# Altium project M2.PrjPcb
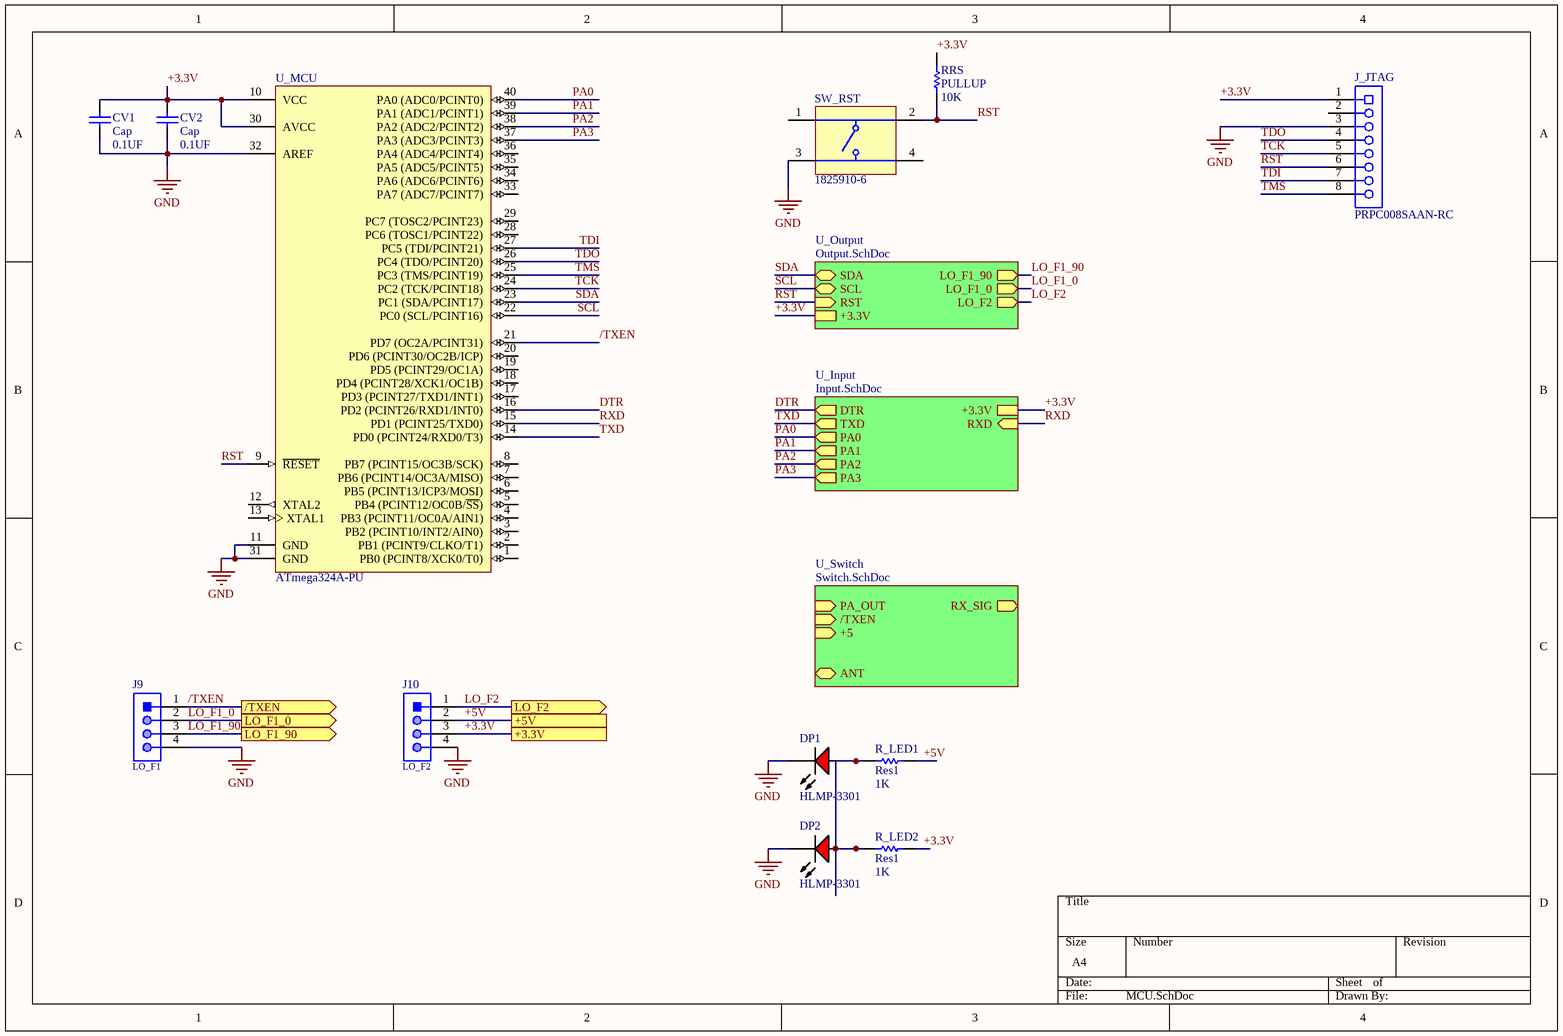
[diagram p0: MCU.SchDoc]
3 sheets, 32 parts. Net scope: hierarchical (ports join the sheet entries above them; power ports are global).
Sheets:
  MCU.SchDoc
    U_Output = Output.SchDoc
    U_Input = Input.SchDoc

## Sheet MCU.SchDoc
size A4; SheetNumber: 1; SheetTotal: 4

### Parts
CV1  Cap  value 0.1UF  [1206]
CV2  Cap  value 0.1UF  [1206]
DP1  HLMP-3301  [AVAG-HLMP-3301-2]
DP2  HLMP-3301  [AVAG-HLMP-3301-2]
J9  LO_F1  [61300411121]
J10  LO_F2  [61300411121]
J_JTAG  PRPC008SAAN-RC  [SLIN-PPPC081LFBN-RC_V]
R_LED1  Res1  value 1K  [AXIAL-0.1-RES]
R_LED2  Res1  value 1K  [AXIAL-0.1-RES]
RRS  PULLUP  value 10K  [AXIAL-0.1-RES]
SW_RST  1825910-6  [TECO-1825910-6_V]
U_MCU  ATmega324A-PU  [40P6]

### Sub-sheets
U_Input = Input.SchDoc: +3.3V, DTR (out), RXD (in), TXD (out), PA0 (out), PA1 (out), PA2 (out), PA3 (out)
U_Output = Output.SchDoc: SDA (bidir), SCL (bidir), RST (in), LO_F1_90 (out), LO_F1_0 (out), LO_F2 (out), +3.3V
U_Switch = Switch.SchDoc (file not in this document): PA_OUT (in), ANT (bidir), /TXEN (in), +5 (in), RX_SIG (out)

### Ports
+3.3V, +5V, /TXEN (out), LO_F1_0 (out), LO_F1_90 (out), LO_F2 (out)

### Nets
GND: CV1.1 CV2.1 DP1.1(K) DP2.1(K) J9.4 J10.4 J_JTAG.3 SW_RST.3 U_MCU.11(GND) U_MCU.31(GND) U_MCU.32(AREF)
+3.3V: CV1.2 CV2.2 J10.3 J_JTAG.1 R_LED2.2 RRS.2 U_MCU.10(VCC) U_MCU.30(AVCC) ; port +3.3V, sheet U_Output/+3.3V, sheet U_Input/+3.3V  [project net  +3.3V]
+5V: J10.2 R_LED1.2 ; port +5V
/TXEN: J9.1 U_MCU.21(PD7_(OC2A/PCINT31)) ; port /TXEN
DTR: U_MCU.16(PD2_(PCINT26/RXD1/INT0)) ; sheet U_Input/DTR
LO_F1_0: J9.2 ; port LO_F1_0, sheet U_Output/LO_F1_0
LO_F1_90: J9.3 ; port LO_F1_90, sheet U_Output/LO_F1_90
LO_F2: J10.1 ; port LO_F2, sheet U_Output/LO_F2
PA0: U_MCU.40(PA0_(ADC0/PCINT0)) ; sheet U_Input/PA0
PA1: U_MCU.39(PA1_(ADC1/PCINT1)) ; sheet U_Input/PA1
PA2: U_MCU.38(PA2_(ADC2/PCINT2)) ; sheet U_Input/PA2
PA3: U_MCU.37(PA3_(ADC3/PCINT3)) ; sheet U_Input/PA3
RST: J_JTAG.6 RRS.1 SW_RST.2 U_MCU.9(~{RESET}) ; sheet U_Output/RST
RXD: U_MCU.15(PD1_(PCINT25/TXD0)) ; sheet U_Input/RXD
SCL: U_MCU.22(PC0_(SCL/PCINT16)) ; sheet U_Output/SCL
SDA: U_MCU.23(PC1_(SDA/PCINT17)) ; sheet U_Output/SDA
TCK: J_JTAG.5 U_MCU.24(PC2_(TCK/PCINT18))
TDI: J_JTAG.7 U_MCU.27(PC5_(TDI/PCINT21))
TDO: J_JTAG.4 U_MCU.26(PC4_(TDO/PCINT20))
TMS: J_JTAG.8 U_MCU.25(PC3_(TMS/PCINT19))
TXD: U_MCU.14(PD0_(PCINT24/RXD0/T3)) ; sheet U_Input/TXD
NetDP1_2: DP1.2(A) DP2.2(A) R_LED1.1 R_LED2.1

Not connected (* = marked no-connect by the designer): J_JTAG 2; SW_RST 1 4; U_MCU 1(PB0_(PCINT8/XCK0/T0)) 2(PB1_(PCINT9/CLKO/T1)) 3(PB2_(PCINT10/INT2/AIN0)) 4(PB3_(PCINT11/OC0A/AIN1)) 5(PB4_(PCINT12/OC0B/~{SS})) 6(PB5_(PCINT13/ICP3/MOSI)) 7(PB6_(PCINT14/OC3A/MISO)) 8(PB7_(PCINT15/OC3B/SCK)) 12(XTAL2) 13(XTAL1) 17(PD3_(PCINT27/TXD1/INT1)) 18(PD4_(PCINT28/XCK1/OC1B)) 19(PD5_(PCINT29/OC1A)) 20(PD6_(PCINT30/OC2B/ICP)) 28(PC6_(TOSC1/PCINT22)) 29(PC7_(TOSC2/PCINT23)) 33(PA7_(ADC7/PCINT7)) 34(PA6_(ADC6/PCINT6)) 35(PA5_(ADC5/PCINT5)) 36(PA4_(ADC4/PCINT4))

### Library data of the parts
CV1 CV2 = CAP CER 0.1UF 50V X7R 1206: Capacitor; Manufacturer Part Number: 885012208087; Designator: C?; Voltage Rating: 50V; Published: 8-Jun-2000; LatestRevisionDate: 17-Jul-2002; LatestRevisionNote: Re-released for DXP Platform.; Publisher: Altium Limited
DP1 DP2 = CMP-2000-06411-1: T-1 3/4 (5 mm) Diffused LED Lamp, 1.9 V, -40 to 100 degC, 2-Pin THD, RoHS, Bulk; Manufacturer: Avago; Forward Current: 25mA; Forward Voltage: 2.4V; Peak Wavelength: 635nm; Shape Type: Circular; High Brightness: No; Main Category: StandardLED; Test Current (It): 10mA; Dominant Wave Length: 626nm; Number of  Elements: 1; Reverse Voltage: 5V; Chip Material: GaP; Product Height (mm): 9.19mm; Lens Type: ColoredDiffused; Viewing Angle: 60deg; Emitting Color: Red; Luminous Intensity: 5.4mcd; Power Dissipation: 85W; DELETED: Compliant; Product Depth (mm): 6.1mm; Package Description: 2-Pin Through Hole LED, Dia 5.85 mm; Mounting Technology: ThroughHole; Manufacturer URL: http://www.avagotech.com/; Package Type: T-13/4; Operating Temp Range: -40Cto100C; Datasheet URL: http://www.avagotech.com/docs/AV02-1558EN; Mounting: ThroughHole; Lens Dimensions: 5.08x5.08x8.3mm; Package Reference: HLMP-3301; Datasheet Version: 03/2015; Pin Count: 2; Packaging: TapeandReel; Type: Uni-Color; Operating Temperature Classification: Industrial; Lum Intensity: 5.4mcd; Rad Hardened: No; Product Length (mm): 6.1mm
J9 J10 = CMP-1502-01064-1: THT Vertical Pin Header WR-PHD, Pitch 2.54 mm, Single Row, 4 pins; Manufacturer: Wurth Elektronik; Withstanding Voltage: 500VAC; Rated Current: 3A; Working Voltage: 250VAC; Pin Number: 4; Gender: Male; Contact Resistance: 20mOhm; Pitch: 2.54mm; Manufacturer URL: http://www.we-online.de; Operating Temperature: -40to105degC; Packaging: Bag; Mounting Technology: THT; Package Reference: 61300411121; Datasheet URL: https://katalog.we-online.de/em/datasheet/6130xx11121.pdf; Publisher: WurthElektronik; Part Number: 61300411121; Row Number: Single; Orientation: Vertical
J_JTAG = CMP-1770-00002-1: Female Header, Pitch 2.54 mm, 1 x 8 Position, Height 8.5 mm, Tail Length 3.2 mm, -40 to 105 degC, RoHS, Bulk; Case\Package: TO-252-3; Rds On Max: 115 mohm; Typical Rise Time: 90 ns; Max Power Dissipation: 2.5 W; Input Capacitance: 350 pF; Elements: 1; Height: 2.39 mm; Min Operating Temperature: -55 degC; RoHSCompliant: true; PackageDescription: Female Header, Pitch 2.54 mm, 1 x 8 Position, Height 8.5 mm, Tail Length 3.2 mm; Length: 6.73 mm; ComponentLink1Description: Datasheet; Package Quantity: 2500; Max Operating Temperature: 150 degC; Width: 6.22 mm; Radiation Hardening: No; Packaging: Tape and Reel; REACH SVHC: No SVHC; Pins: 3; PackageReference: PPPC081LFBN-RC; ComponentLink1URL: http://sullinscorp.com/catalogs/101_PAGE114-115_.100_FEMALE_HDR.pdf; DatasheetVersion: Jan-15; Mount: Surface Mount
R_LED1 R_LED2 = RES 1K OHM 5% 1/4W AXIAL: Resistor; Manufacturer Part Number: CFR-25JB-52-1K; Designator: R?; Power Rating: 1/4W; Tolerance: 0.05; Published: 8-Jun-2000; LatestRevisionDate: 17-Jul-2002; LatestRevisionNote: Re-released for DXP Platform.; Publisher: Altium Limited
RRS = RES 10K OHM 5% 1/4W AXIAL: Resistor; Manufacturer Part Number: CFR-25JB-52-10K; Designator: R?; Power Rating: 1/4W; Tolerance: 0.05; Published: 8-Jun-2000; LatestRevisionDate: 17-Jul-2002; LatestRevisionNote: Re-released for DXP Platform.; Publisher: Altium Limited
SW_RST = CMP-1684-00021-1: Tact Switch, SPST-NO, 0.05 A, -35 to 85 degC, 4-Pin THD, RoHS, Bulk; Manufacturer: TE Connectivity; Maximum Contact Resistance: 100mOhm; Mechanical Life: 100000Cycles; Bushing Type: Unthreaded; Switch Configuration: OFF(ON); Maximum DC Voltage Rating: 24V; Contact Rating @ Voltage: 0.05A@24VDC; Actuator Color: Black; Body Orientation: Straight; Function: MomentaryContact; Illumination: N/R; Actuator Style: RoundButton; Actuator Material: PolybutyleneTerephthalate; Dielectric Strength: 500VAC; Pole Throw Configuration: SPST; Actuator Length: 1.4mm; Product Weight: N/A; Contact Material: CopperAlloy; Housing Material: N/A; Terminal Type: PCPins; Minimum Insulation Resistance: 100MOhm; Package Description: 4-Pin Through Hole Device, Body 5.99 x 5.99 mm, Pitch 6.5 mm; Part No: 1825910-6; Package Reference: THD; Base Material: N/A; Manufacturer URL: http://www.te.com; Contact Plating: Silver; RoHS: Yes; Datasheet Version: Rev. C9; Electrical Life: 100000Cycles; Maximum AC Voltage Rating: N/A; Thread Size: N/R; Operating Temperature: -35to85C; Mounting: ThroughHole; Dimension: 5.99x5mm; Datasheet URL: http://www.te.com/commerce/DocumentDelivery/DDEController?Action=showdoc&DocId=Customer+Drawing%7F1825910%7FC9%7Fpdf%7FEnglish%7FENG_CD_1825910_C9.pdf%7F1825910-6; Family: 1825910; Seal Location: N/A; Seal Description: N/A; Packaging: N/A
U_MCU = CMP-0095-00016-2: 8-bit AVR Microcontroller, 32KB Flash, 1KB EEPROM, 2KB SRAM, 40-pin PDIP, Industrial Grade (-40°C to 85°C); ComponentLink2URL: http://www.atmel.com/dyn/resources/prod_documents/doc8272.pdf; RevisionNote: DatasheetVersion & Sch pin names updated. URLs added.; PackageReference: 40P6; PackageDescription: 40-lead (0.600"/15.24mm Wide) Plastic Dual Inline Package (PDIP); ComponentLink3Description: ATmega164A/164PA/324A/324PA/644A/644PA/1284/1284P Summary; ComponentLink3URL: http://www.atmel.com/dyn/resources/prod_documents/8272S.pdf; Code_JEDEC: MS-011-AC; ComponentLink1URL: http://www.atmel.com/; PackageVersion: revB, Sep-2001; DatasheetVersion: revC, Jun-2011; ComponentLink2Description: ATmega164A/164PA/324A/324PA/644A/644PA/1284/1284P Datasheet; ComponentLink1Description: Manufacturer URL

## Sheet Output.SchDoc
size A4; SheetNumber: 3; SheetTotal: 4
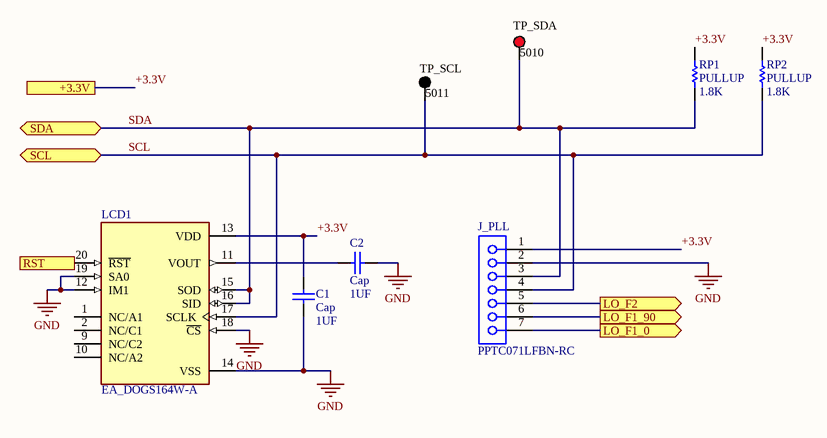
[diagram p1: Output.SchDoc]

### Parts
C1  Cap  value 1UF  [RADIAL-0.1]
C2  Cap  value 1UF  [RADIAL-0.1]
J_PLL  PPTC071LFBN-RC  [SMTC-SSQ-107-01-X-S]
LCD1  EA_DOGS164W-A  [LCD_EA_DOGS164W-A]
RP1  PULLUP  value 1.8K  [AXIAL-0.1-RES]
RP2  PULLUP  value 1.8K  [AXIAL-0.1-RES]
TP_SCL  5011  [KSTN-5011_V]
TP_SDA  5010  [KSTN-5010_V]

### Ports
+3.3V, LO_F1_0 (out), LO_F1_90 (out), LO_F2 (out), RST (in), SCL (bidir), SDA (bidir)

### Nets
GND: C1.1 C2.1 J_PLL.2 LCD1.12(IM1) LCD1.14(VSS) LCD1.18(~{CS}) LCD1.19(SA0)
+3.3V: C1.2 J_PLL.1 LCD1.13(VDD) RP1.2 RP2.2 ; port +3.3V  [project net  +3.3V]
LO_F1_0: J_PLL.7 ; port LO_F1_0
LO_F1_90: J_PLL.6 ; port LO_F1_90
LO_F2: J_PLL.5 ; port LO_F2
RST: LCD1.20(~{RST}) ; port RST
SCL: J_PLL.4 LCD1.17(SCLK) RP2.1 TP_SCL.1 ; port SCL
SDA: J_PLL.3 LCD1.15(SOD) LCD1.16(SID) RP1.1 TP_SDA.1 ; port SDA
NetC2_2: C2.2 LCD1.11(VOUT)

Not connected (* = marked no-connect by the designer): LCD1 1(NC/A1) 2(NC/C1) 9(NC/C2) 10(NC/A2)

### Library data of the parts
C1 C2 = CAP ALUM 1UF 20% 100V RADIAL: Capacitor; Manufacturer Part Number: ESE105M100AC3EA; Designator: C?; Voltage Rating: 100V; Published: 8-Jun-2000; LatestRevisionDate: 17-Jul-2002; LatestRevisionNote: Re-released for DXP Platform.; Publisher: Altium Limited
J_PLL = CMP-1023-00284-1: SQ Post Socket, Through-hole, Vertical, -55 to 125 degC, 2.54 mm Pitch, 7-Pin, Female, RoHS; PartNumber: SSQ-107-01-G-S; Manufacturer: Samtec; Pitch: 2.54 mm; PackageDescription: Assembly, Socket Strip .025[0.64] SQ Tail; PackageReference: SSQ-107-01-X-S; ComponentLink2URL: http://www.samtec.com/documents/webfiles/pdf/SSQ_TH.PDF; ComponentLink1URL: http://www.samtec.com; ComponentLink3Description: Package Specification; PackageVersion: BD, 6/1987; RoHS: True; DatasheetVersion: F-214; Mounting Technology: Through-hole; ComponentLink3URL: http://www.samtec.com/documents/webfiles/cpdf/SSQ-1XX-XX-XXX-X-XX-XXX-XX-X-MKT.pdf; ComponentLink1Description: Manufacturer URL; Temperature Range: -55 to 125 degC; Orientation: Vertical; ComponentLink2Description: Datasheet
LCD1 = EA_DOGS164W-A: Character LCD Display Module Transflective 5 x 32 Dots FSTN - Film Super-Twisted Nematic Without Backlight IÂ²C, SPI 40.00mm x 33.00mm x 2.60mm; MF: Display Visions; MP: EA DOGS164W-A; Value: *; Check_prices: https://www.snapeda.com/parts/EA%20DOGS164W-A/Focus+Display+Solutions/view-part/?ref=eda; Price: None; SnapEDA_Link: https://www.snapeda.com/parts/EA%20DOGS164W-A/Focus+Display+Solutions/view-part/?ref=snap; Purchase-URL: https://pricing.snapeda.com/search/part/EA DOGS164W-A/?ref=eda; Package: None; Availability: In Stock
RP1 RP2 = RES 1.8K OHM 5% 1/4W AXIAL: Resistor; Manufacturer Part Number: CFR-25JB-52-1K8; Designator: R?; Power Rating: 1/4W; Tolerance: 0.05; Published: 8-Jun-2000; LatestRevisionDate: 17-Jul-2002; LatestRevisionNote: Re-released for DXP Platform.; Publisher: Altium Limited
TP_SCL = CMP-1672-00003-4: Test Point, Black, Through Hole, RoHS, Bulk; Manufacturer: Keystone; ComponentLink2URL: http://www.keyelco.com/product-pdf.cfm?p=1320; Colour: Black; Pins: 1; REACH SVHC: No SVHC; ComponentLink1URL: http://www.keyelco.com/; PackageReference: 5011; Contact Plating: Silver; Package Quantity: 100; Packaging: Bulk; RoHSCompliant: true; Height: 8.12 mm; PackageDescription: 1-Pin Through Hole Device, Dia 3.17 mm; Mount: Through Hole; Mounting Technology: Through Hole; DatasheetVersion: Rev. F, 12/2013; ComponentLink1Description: Manufacturer URL; Contact Material: Bronze; ComponentLink2Description: Datasheet
TP_SDA = CMP-1672-00002-4: Test Point, Red, Through Hole, RoHS, Bulk; Manufacturer: Keystone; Contact Material: Bronze; Mounting Technology: Through Hole; RoHSCompliant: true; Pins: 1; Package Quantity: 100; ComponentLink2Description: Datasheet; Height: 8.12 mm; ComponentLink1URL: http://www.keyelco.com/; DatasheetVersion: Rev. F, 12/2013; Mount: Through Hole; PackageReference: 5010; Contact Plating: Silver; Packaging: Bulk; Colour: Red; REACH SVHC: No SVHC; PackageDescription: 1-Pin Through Hole Device, Dia 3.17 mm; ComponentLink2URL: http://www.keyelco.com/product-pdf.cfm?p=1319; ComponentLink1Description: Manufacturer URL

## Sheet Input.SchDoc
size A4; SheetNumber: 2; SheetTotal: 4
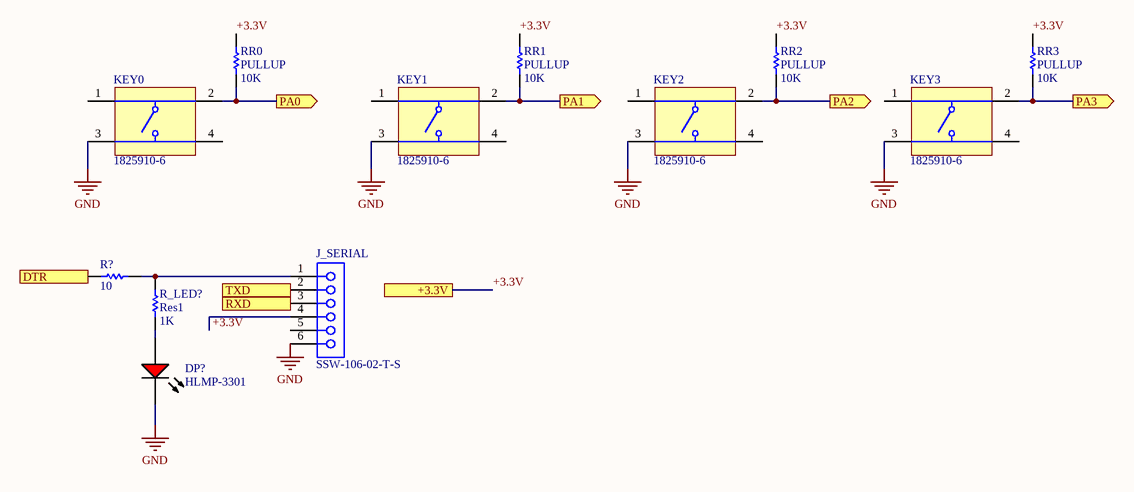
[diagram p2: Input.SchDoc]

### Parts
DP?  HLMP-3301  [AVAG-HLMP-3301-2]
J_SERIAL  SSW-106-02-T-S  [SMTC-SSW-106-02-X-S]
KEY0  1825910-6  [TECO-1825910-6_V]
KEY1  1825910-6  [TECO-1825910-6_V]
KEY2  1825910-6  [TECO-1825910-6_V]
KEY3  1825910-6  [TECO-1825910-6_V]
R?  10  [AXIAL-0.1-RES]
R_LED?  Res1  value 1K  [AXIAL-0.1-RES]
RR0  PULLUP  value 10K  [AXIAL-0.1-RES]
RR1  PULLUP  value 10K  [AXIAL-0.1-RES]
RR2  PULLUP  value 10K  [AXIAL-0.1-RES]
RR3  PULLUP  value 10K  [AXIAL-0.1-RES]

### Ports
+3.3V, DTR (out), PA0 (out), PA1 (out), PA2 (out), PA3 (out), RXD (in), TXD (out)

### Nets
GND: DP?.1(K) J_SERIAL.6 KEY0.3 KEY1.3 KEY2.3 KEY3.3
 +3.3V: J_SERIAL.4 RR0.2 RR1.2 RR2.2 RR3.2 ; port +3.3V  [also labelled +3.3V]
DTR: R?.1 ; port DTR
PA0: KEY0.2 RR0.1 ; port PA0
PA1: KEY1.2 RR1.1 ; port PA1
PA2: KEY2.2 RR2.1 ; port PA2
PA3: KEY3.2 RR3.1 ; port PA3
RXD: J_SERIAL.3 ; port RXD
TXD: J_SERIAL.2 ; port TXD
NetDP?_2: DP?.2(A) R_LED?.1
NetJ_SERIAL_1: J_SERIAL.1 R?.2 R_LED?.2

Not connected (* = marked no-connect by the designer): J_SERIAL 5; KEY0 1 4; KEY1 1 4; KEY2 1 4; KEY3 1 4

### Library data of the parts
DP? = CMP-2000-06411-1: as DP1 on sheet MCU; Package Description: 2-Pin Through Hole LED, Dia 5.85 mm; Mounting Technology: ThroughHole; Manufacturer URL: http://www.avagotech.com/; Package Type: T-13/4; Operating Temp Range: -40Cto100C; Datasheet URL: http://www.avagotech.com/docs/AV02-1558EN; Mounting: ThroughHole; Lens Dimensions: 5.08x5.08x8.3mm; Package Reference: HLMP-3301; Datasheet Version: 03/2015; Pin Count: 2; Packaging: TapeandReel; Type: Uni-Color; Operating Temperature Classification: Industrial; Lum Intensity: 5.4mcd; Rad Hardened: No; Product Length (mm): 6.1mm
J_SERIAL = CMP-1023-00360-1: SQ Post Socket, Through-hole, Vertical, -55 to 105 degC, 2.54mm Pitch, 6-Pin, Female, RoHS; Manufacturer: Samtec; ComponentLink1URL: http://www.samtec.com; Temperature Range: -55 to 105 degC; Pitch: 2.54 mm; Mounting Technology: Through-hole; DatasheetVersion: F-214; ComponentLink1Description: Manufacturer URL; PackageVersion: CA, 6/1987; ComponentLink3Description: Package Specification; PackageDescription: Assembly, Socket Strip .016 X .031 Tail; ComponentLink2Description: Datasheet; ComponentLink2URL: http://www.samtec.com/documents/webfiles/pdf/SSW_TH.PDF; PackageReference: SSW-106-02-X-S; ComponentLink3URL: http://www.samtec.com/documents/webfiles/cpdf/SSW-1XX-XX-XXX-X-XX-XXX-XX-MKT.pdf; RoHS: True; PartNumber: SSW-106-02-T-S; Orientation: Vertical
KEY0-KEY3 = CMP-1684-00021-1: as SW_RST on sheet MCU; Product Weight: N/A; Contact Material: CopperAlloy; Housing Material: N/A; Terminal Type: PCPins; Minimum Insulation Resistance: 100MOhm; Package Description: 4-Pin Through Hole Device, Body 5.99 x 5.99 mm, Pitch 6.5 mm; Part No: 1825910-6; Package Reference: THD; Base Material: N/A; Manufacturer URL: http://www.te.com; Contact Plating: Silver; RoHS: Yes; Datasheet Version: Rev. C9; Electrical Life: 100000Cycles; Maximum AC Voltage Rating: N/A; Thread Size: N/R; Operating Temperature: -35to85C; Mounting: ThroughHole; Dimension: 5.99x5mm; Datasheet URL: http://www.te.com/commerce/DocumentDelivery/DDEController?Action=showdoc&DocId=Customer+Drawing%7F1825910%7FC9%7Fpdf%7FEnglish%7FENG_CD_1825910_C9.pdf%7F1825910-6; Family: 1825910; Seal Location: N/A; Seal Description: N/A; Packaging: N/A
R? = RES 10 OHM 5% 1/4W AXIAL: Resistor; Manufacturer Part Number: CFR-25JB-52-10R; Designator: R?; Power Rating: 1/4W; Tolerance: 0.05; Published: 8-Jun-2000; LatestRevisionDate: 17-Jul-2002; LatestRevisionNote: Re-released for DXP Platform.; Publisher: Altium Limited
R_LED? = RES 1K OHM 5% 1/4W AXIAL: as R_LED1 on sheet MCU; Published: 8-Jun-2000; LatestRevisionDate: 17-Jul-2002; LatestRevisionNote: Re-released for DXP Platform.; Publisher: Altium Limited
RR0-RR3 = RES 10K OHM 5% 1/4W AXIAL: as RRS on sheet MCU; Published: 8-Jun-2000; LatestRevisionDate: 17-Jul-2002; LatestRevisionNote: Re-released for DXP Platform.; Publisher: Altium Limited

## Nets that join several sheets
GND: MCU (11 pins), Output (7 pins), Input (6 pins)
 +3.3V: MCU (8 pins), Output (5 pins), Input (5 pins)
DTR: MCU (U_MCU.16), Input (R?.1)
LO_F1_0: MCU (J9.2), Output (J_PLL.7)
LO_F1_90: MCU (J9.3), Output (J_PLL.6)
LO_F2: MCU (J10.1), Output (J_PLL.5)
PA0: MCU (U_MCU.40), Input (KEY0.2 RR0.1)
PA1: MCU (U_MCU.39), Input (KEY1.2 RR1.1)
PA2: MCU (U_MCU.38), Input (KEY2.2 RR2.1)
PA3: MCU (U_MCU.37), Input (KEY3.2 RR3.1)
RST: MCU (J_JTAG.6 RRS.1 SW_RST.2 U_MCU.9), Output (LCD1.20)
RXD: MCU (U_MCU.15), Input (J_SERIAL.3)
SCL: MCU (U_MCU.22), Output (J_PLL.4 LCD1.17 RP2.1 TP_SCL.1)
SDA: MCU (U_MCU.23), Output (5 pins)
TXD: MCU (U_MCU.14), Input (J_SERIAL.2)